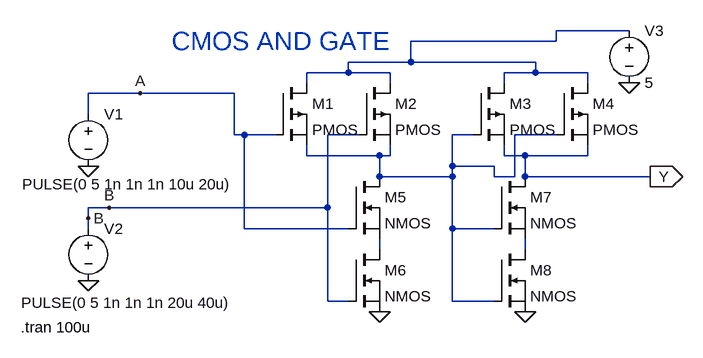
[diagram p0: schematic CMOS_AND.asc]
CMOS_AND.asc, the LTspice schematic file:
Version 4.1
SHEET 1 880 680
WIRE 608 0 496 0
WIRE 496 16 496 0
WIRE 496 16 272 16
WIRE 272 48 272 16
WIRE 272 48 176 48
WIRE 464 48 272 48
WIRE 176 64 176 48
WIRE 176 64 112 64
WIRE 240 64 176 64
WIRE 464 64 464 48
WIRE 464 64 416 64
WIRE 544 64 464 64
WIRE 112 80 112 64
WIRE 240 80 240 64
WIRE 416 80 416 64
WIRE 544 80 544 64
WIRE -144 96 -224 96
WIRE 0 96 -144 96
WIRE -224 128 -224 96
WIRE 0 160 0 96
WIRE 16 160 0 160
WIRE 64 160 16 160
WIRE 192 160 144 160
WIRE 368 160 336 160
WIRE 496 160 432 160
WIRE 112 192 112 176
WIRE 224 192 112 192
WIRE 240 192 240 176
WIRE 240 192 224 192
WIRE 416 192 416 176
WIRE 448 192 416 192
WIRE 544 192 544 176
WIRE 544 192 448 192
WIRE 336 208 336 160
WIRE 400 208 336 208
WIRE 224 224 224 192
WIRE 336 224 336 208
WIRE 336 224 224 224
WIRE 400 224 400 208
WIRE 432 224 432 160
WIRE 432 224 400 224
WIRE 448 224 448 192
WIRE 640 224 448 224
WIRE -192 272 -224 272
WIRE 144 272 144 160
WIRE 144 272 -192 272
WIRE -224 288 -224 272
WIRE -224 304 -224 288
WIRE 16 304 16 160
WIRE 176 304 16 304
WIRE 336 304 336 224
WIRE 400 304 336 304
WIRE 224 336 224 320
WIRE 448 336 448 320
WIRE 144 416 144 272
WIRE 176 416 144 416
WIRE 336 416 336 304
WIRE 400 416 336 416
FLAG 224 432 0
FLAG 448 432 0
FLAG 640 224 Y
IOPIN 640 224 Out
FLAG -224 208 0
FLAG -224 384 0
FLAG 608 80 0
FLAG -144 96 A
FLAG -224 288 B
FLAG -192 272 B
SYMBOL pmos 64 80 R0
SYMATTR InstName M1
SYMBOL pmos 192 80 R0
SYMATTR InstName M2
SYMBOL pmos 368 80 R0
SYMATTR InstName M3
SYMBOL pmos 496 80 R0
SYMATTR InstName M4
SYMBOL nmos 176 224 R0
SYMATTR InstName M5
SYMBOL nmos 176 336 R0
SYMATTR InstName M6
SYMBOL nmos 400 224 R0
SYMATTR InstName M7
SYMBOL nmos 400 336 R0
SYMATTR InstName M8
SYMBOL voltage -224 112 R0
WINDOW 3 -102 124 Left 2
WINDOW 123 0 0 Left 0
WINDOW 39 0 0 Left 0
SYMATTR InstName V1
SYMATTR Value PULSE(0 5 1n 1n 1n 10u 20u)
SYMBOL voltage -224 288 R0
WINDOW 3 -103 130 Left 2
WINDOW 123 0 0 Left 0
WINDOW 39 0 0 Left 0
SYMATTR InstName V2
SYMATTR Value PULSE(0 5 1n 1n 1n 20u 40u)
SYMBOL voltage 608 -16 R0
WINDOW 123 0 0 Left 0
WINDOW 39 0 0 Left 0
SYMATTR InstName V3
SYMATTR Value 5
TEXT -96 16 Left 4 ;CMOS AND GATE
TEXT -328 456 Left 2 !.tran 100u

The netlist it stands for:
* CMOS_AND.asc
M1 N001 A N002 N002 PMOS
M2 N001 B N002 N002 PMOS
M3 N001 N002 Y Y PMOS
M4 N001 N002 Y Y PMOS
M5 N002 A N003 N003 NMOS
M6 N003 B 0 0 NMOS
M7 Y N002 N004 N004 NMOS
M8 N004 N002 0 0 NMOS
V1 A 0 PULSE(0 5 1n 1n 1n 10u 20u)
V2 B 0 PULSE(0 5 1n 1n 1n 20u 40u)
V3 N001 0 5
.model NMOS NMOS
.model PMOS PMOS
.lib standard.mos
* CMOS AND GATE
.tran 100u
.backanno
.end